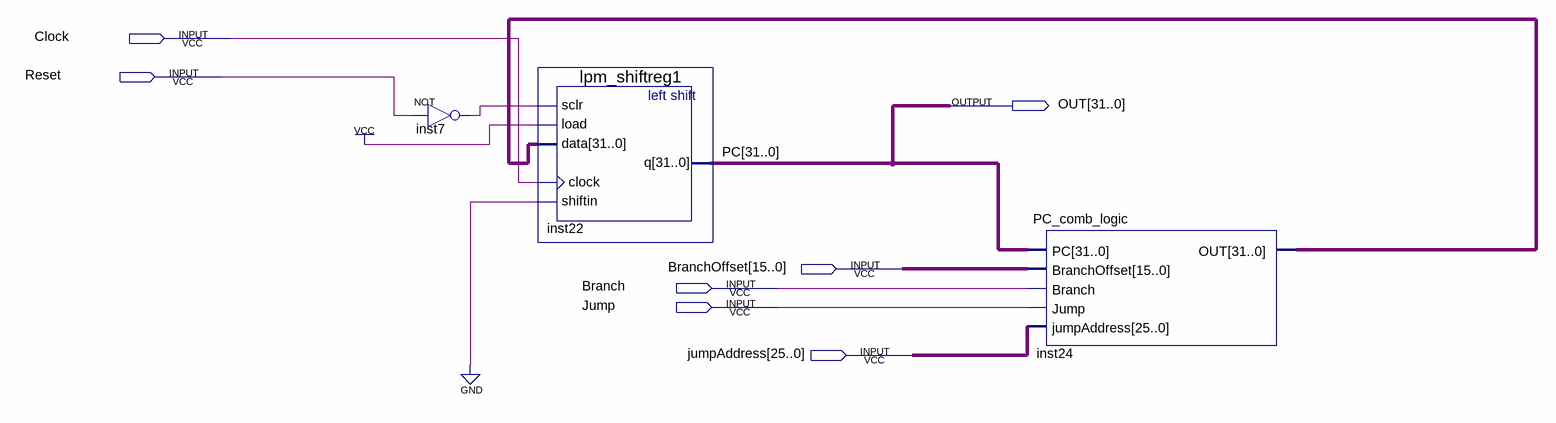
[diagram p0: schematic sheet]
// Quartus schematic pc_calculator_module.bdf as structural Verilog: 3 symbols, 7 pins
module pc_calculator_module (
  input  Clock,
  input  Reset,
  input  [15:0] BranchOffset,
  input  Branch,
  input  Jump,
  input  [25:0] jumpAddress,
  output [31:0] OUT
);

  wire inst7_out;
  wire [31:0] inst24_out;

  not inst7 (inst7_out, Reset);
  lpm_shiftreg1 inst22 (.sclr(inst7_out), .load(1'b1), .data(inst24_out), .clock(Clock), .shiftin(1'b0), .q(OUT));
  PC_comb_logic inst24 (
    .PC(OUT), .BranchOffset(BranchOffset), .Branch(Branch), .Jump(Jump), .jumpAddress(jumpAddress),
    .OUT(inst24_out));

  // Other names for the same wires on the sheet: PC[31:0] = OUT
endmodule
